# Altium schematic sheet subDIn.SchDoc
size A4
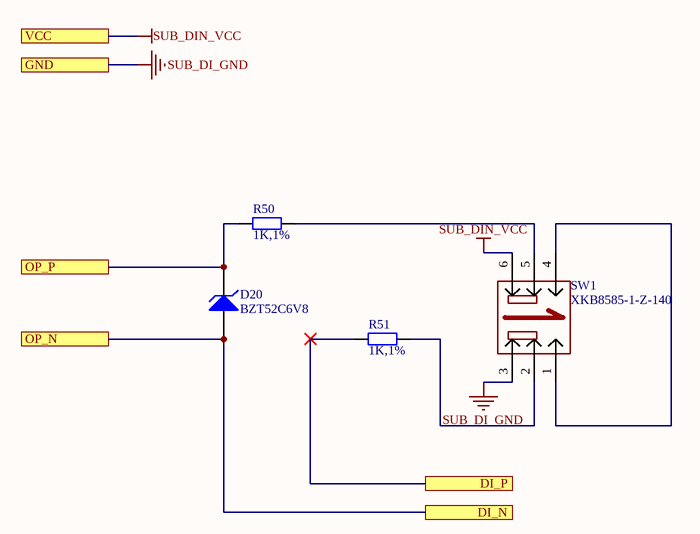
[diagram p0: subDIn.SchDoc]

## Parts
D20  BZT52C6V8  [SOD-123]
R50  1K,1%  [R0603]
R51  1K,1%  [R0603]
SW1  XKB8585-1-Z-140  [SW-TH_6P-L8.6-W8.6-P2.50-LS5.4]

## Ports
DI_N, DI_P, GND, OP_N, OP_P, VCC

## Nets
SUB_DI_GND: SW1.3 ; port GND
SUB_DIN_VCC: SW1.6 ; port VCC
DI_N: D20.1(A) ; port OP_N, port DI_N
DI_P: R51.2 ; port DI_P
OP_P: D20.2(K) R50.2 ; port OP_P
NetR50_1: R50.1 SW1.5
NetR51_1: R51.1 SW1.2
NetSW1_1: SW1.1 SW1.4

## Library data of the parts
D20 = BZT52C6V8: Surface Mount Zener Diode; Published: 8-Jun-2000; LatestRevisionDate: 17-Jul-2002; LatestRevisionNote: Re-released for DXP Platform.; DatasheetDocument: REV. L-2; PackageReference: SOD-123; Publisher: Altium Limited; ComponentLink1Description: Manufacturer Link; ComponentLink1URL: http://www.vishay.com/
R50 R51 = 电阻: Value: 5.1K, 1%; Type: 贴片电阻
SW1 = XKB8585-1-Z-140: 按键开关 六脚 外扣 有声自锁